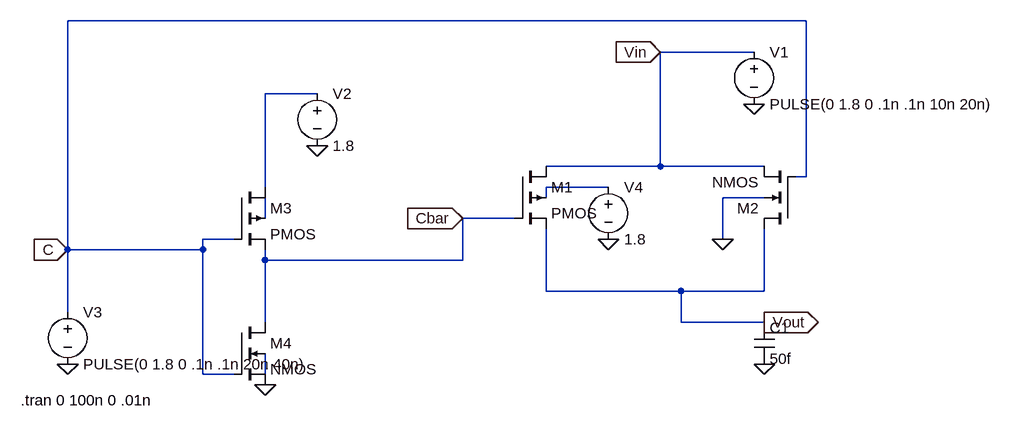
[diagram p0: schematic Buffer.asc]
Buffer.asc, the LTspice schematic file:
Version 4
SHEET 1 880 680
WIRE 240 0 -896 0
WIRE 160 48 16 48
WIRE -512 112 -592 112
WIRE 16 224 16 48
WIRE 16 224 -160 224
WIRE 176 224 16 224
WIRE 240 240 240 0
WIRE 240 240 224 240
WIRE -592 256 -592 112
WIRE -64 256 -160 256
WIRE -160 272 -160 256
WIRE 176 272 112 272
WIRE -592 304 -592 272
WIRE -208 304 -288 304
WIRE -640 336 -688 336
WIRE 112 336 112 272
WIRE -896 352 -896 0
WIRE -688 352 -688 336
WIRE -688 352 -896 352
WIRE -592 368 -592 352
WIRE -288 368 -288 304
WIRE -288 368 -592 368
WIRE -160 416 -160 320
WIRE 48 416 -160 416
WIRE 176 416 176 320
WIRE 176 416 48 416
WIRE -896 448 -896 352
WIRE -592 464 -592 368
WIRE 48 464 48 416
WIRE 176 464 48 464
WIRE -688 544 -688 352
WIRE -640 544 -688 544
WIRE -592 544 -592 512
FLAG 112 336 0
FLAG 176 528 0
FLAG 176 464 Vout
IOPIN 176 464 Out
FLAG 160 128 0
FLAG -512 192 0
FLAG -592 560 0
FLAG -288 304 Cbar
IOPIN -288 304 In
FLAG -896 528 0
FLAG -896 352 C
IOPIN -896 352 In
FLAG 16 48 Vin
IOPIN 16 48 In
FLAG -64 336 0
SYMBOL nmos4 224 320 R180
SYMATTR InstName M2
SYMATTR Value2 l=180nm w=270nm
SYMBOL pmos4 -208 224 R0
SYMATTR InstName M1
SYMATTR Value2 l=180nm w=810nm
SYMBOL cap 160 464 R0
SYMATTR InstName C1
SYMATTR Value 50f
SYMBOL pmos4 -640 256 R0
SYMATTR InstName M3
SYMATTR Value2 l=180nm w=810nm
SYMBOL nmos4 -640 464 R0
SYMATTR InstName M4
SYMATTR Value2 l=180nm w=270mn
SYMBOL voltage 160 32 R0
WINDOW 123 0 0 Left 0
WINDOW 39 0 0 Left 0
SYMATTR InstName V1
SYMATTR Value PULSE(0 1.8 0 .1n .1n 10n 20n)
SYMBOL voltage -512 96 R0
WINDOW 123 0 0 Left 0
WINDOW 39 0 0 Left 0
SYMATTR InstName V2
SYMATTR Value 1.8
SYMBOL voltage -896 432 R0
WINDOW 123 0 0 Left 0
WINDOW 39 0 0 Left 0
SYMATTR InstName V3
SYMATTR Value PULSE(0 1.8 0 .1n .1n 20n 40n)
SYMBOL voltage -64 240 R0
WINDOW 123 0 0 Left 0
WINDOW 39 0 0 Left 0
SYMATTR InstName V4
SYMATTR Value 1.8
TEXT -968 584 Left 2 !.tran 0 100n 0 .01n

The netlist it stands for:
* Buffer.asc
M2 Vout C Vin 0 NMOS l=180nm w=270nm
M1 Vin Cbar Vout N002 PMOS l=180nm w=810nm
C1 Vout 0 50f
M3 N001 C Cbar N003 PMOS l=180nm w=810nm
M4 Cbar C 0 N004 NMOS l=180nm w=270mn
V1 Vin 0 PULSE(0 1.8 0 .1n .1n 10n 20n)
V2 N001 0 1.8
V3 C 0 PULSE(0 1.8 0 .1n .1n 20n 40n)
V4 N002 0 1.8
.model NMOS NMOS
.model PMOS PMOS
.lib standard.mos
.tran 0 100n 0 .01n
.backanno
.end